# Altium schematic sheet TYPE_C&POWER.SchDoc
size A3
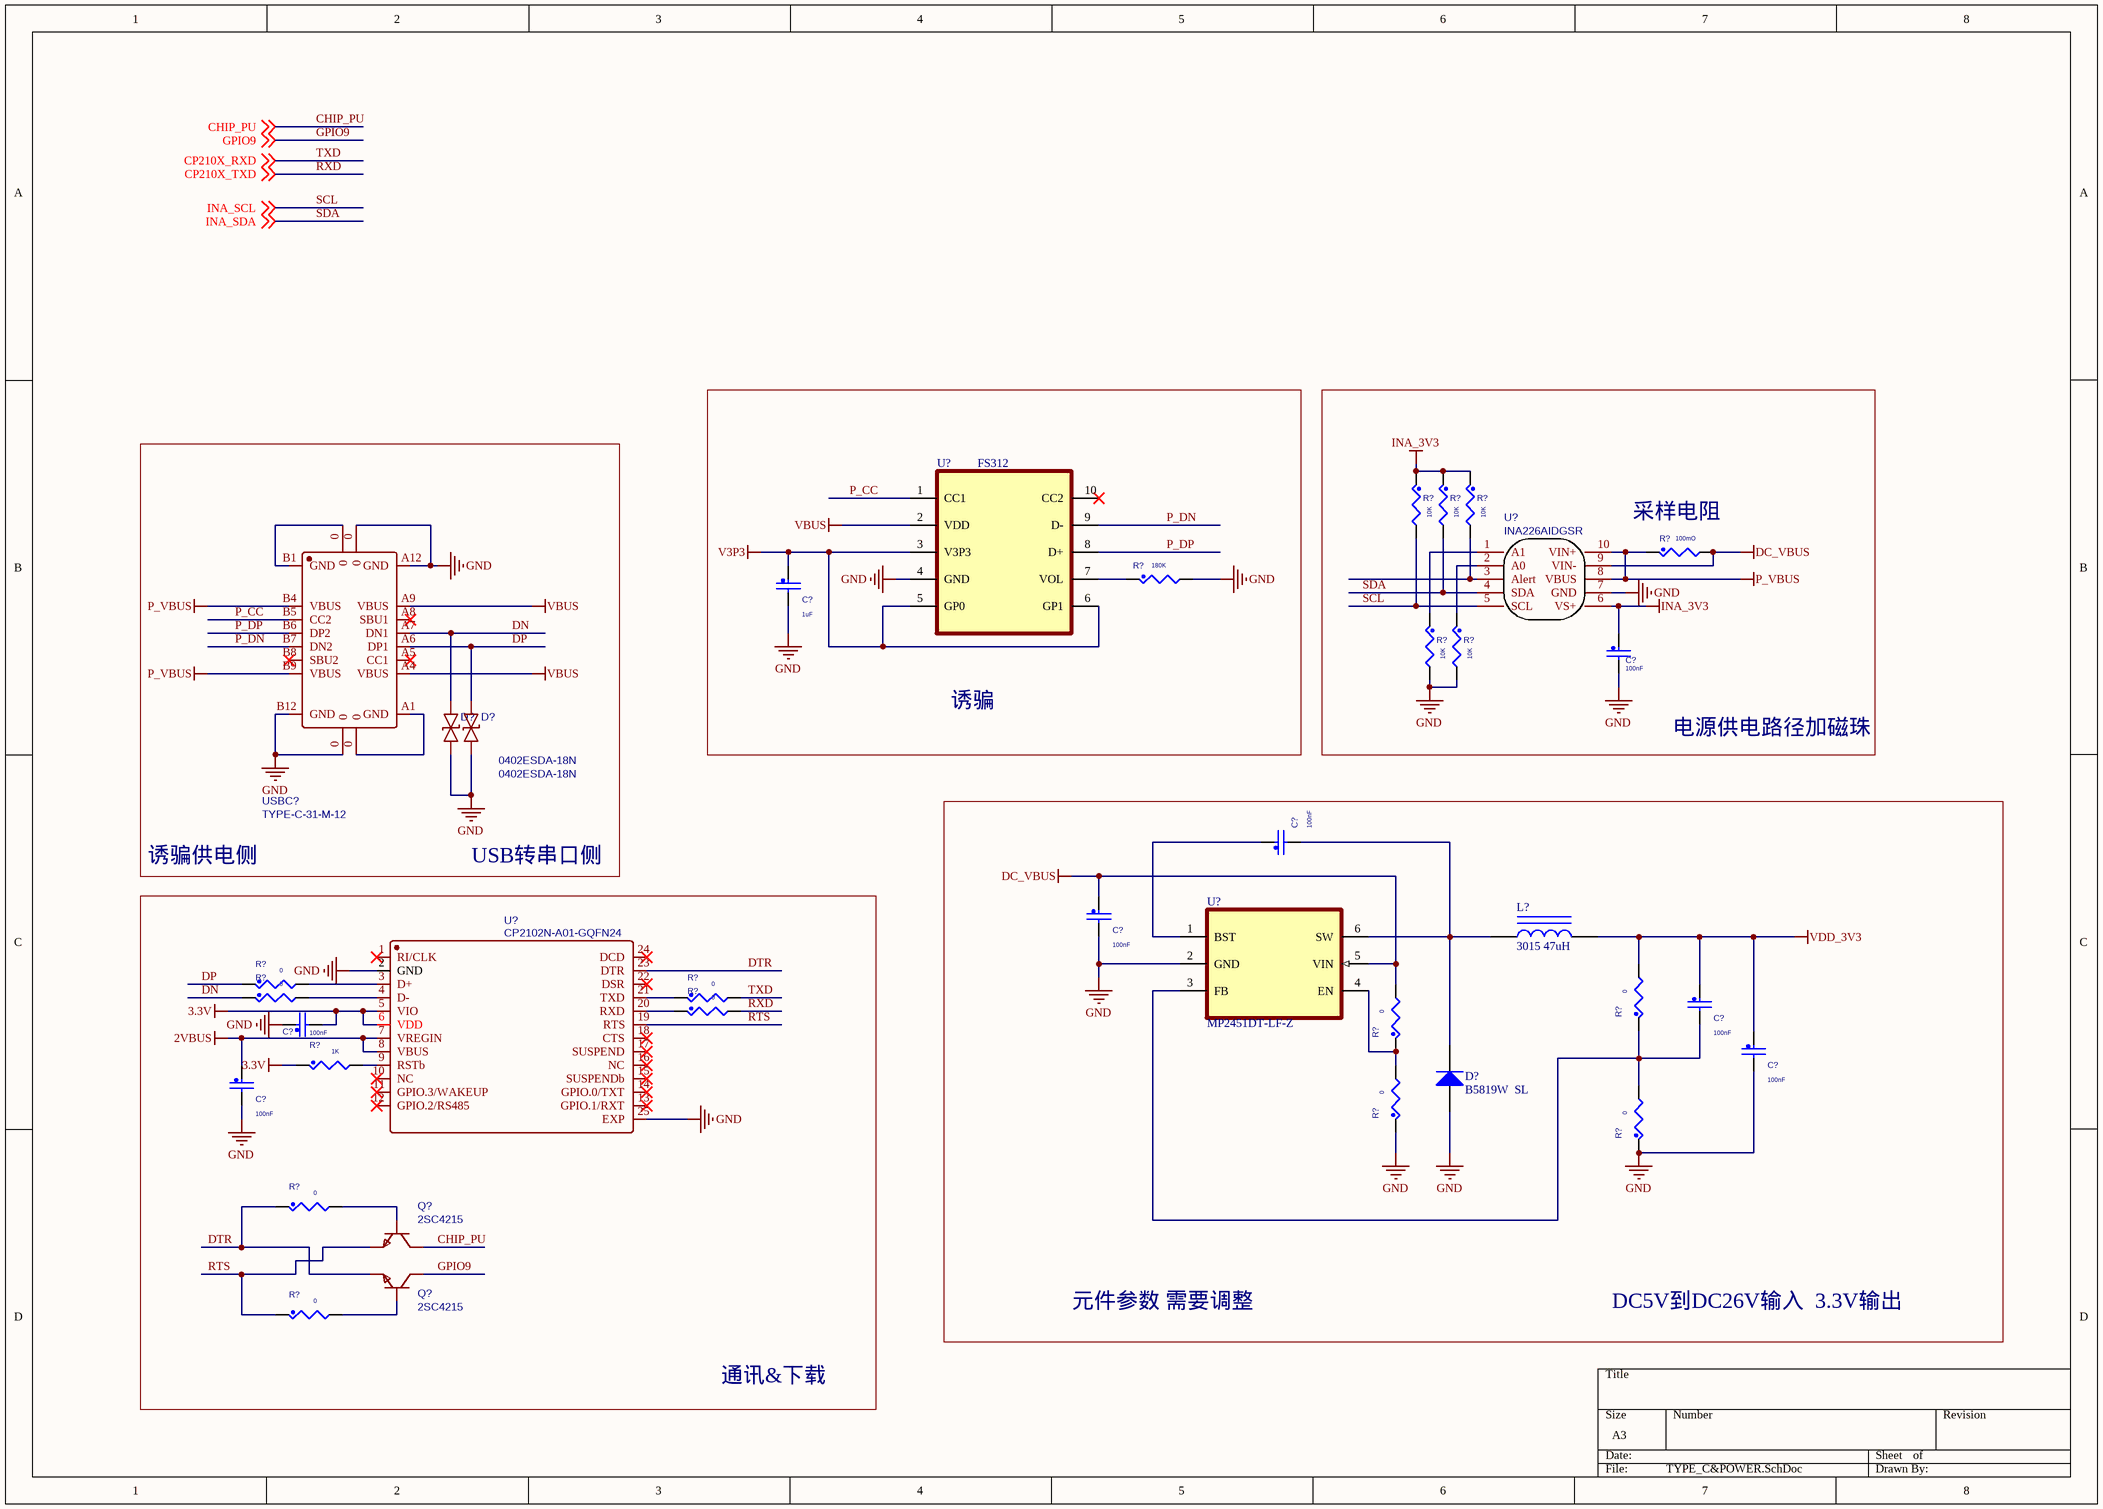
[diagram p0: TYPE_C&POWER.SchDoc]

## Parts
(Parts that share a designator on the sheet are numbered #1, #2 ... from top to bottom, then left to right.)
C?#1  1uF  [C0603]
C?#2  100nF  [C0603]
C?#3  100nF  [C0603]
C?#4  100nF  [C0603]
C?#5  100nF  [C0603]
C?#6  100nF  [C0603]
C?#7  100nF  [C0603]
C?#8  100nF  [C0603]
D?#1  0402ESDA-18N  [D0402-BI]
D?#2  0402ESDA-18N  [D0402-BI]
D?#3  B5819W  SL  [SOD-123]
L?  3015 47uH  [0603_L]
Q?#1  2SC4215  [SOT-323-3_L2.0-W1.3-P1.30-LS2.1-BR]
Q?#2  2SC4215  [SOT-323-3_L2.0-W1.3-P1.30-LS2.1-BR]
R?#1  10K  [R0603]
R?#2  10K  [R0603]
R?#3  10K  [R0603]
R?#4  100mO  [R0603]
R?#5  180K  [R0603]
R?#6  10K  [R0603]
R?#7  10K  [R0603]
R?#8  0  [R0603]
R?#9  0  [R0603]
R?#10  0  [R0603]
R?#11  0  [R0603]
R?#12  0  [R0603]
R?#13  0  [R0603]
R?#14  1K  [R0603]
R?#15  0  [R0603]
R?#16  0  [R0603]
R?#17  0  [R0603]
R?#18  0  [R0603]
U?#1  FS312  [FS312]
U?#2  INA226AIDGSR  [MSOP-10_L3.0-W3.0-P0.50-LS5.0-BL]
U?#3  MP2451DT-LF-Z  [SOT-23-6_L2.9-W1.6-P0.95-LS2.8-BR]
U?#4  CP2102N-A01-GQFN24  [QFN-24_L4.0-W4.0-P0.50-BL-EP2.6]
USBC?  TYPE-C-31-M-12  [USB-C_SMD-TYPE-C-31-M-12]

## Blocks framed on the sheet
诱骗: C?#1 R?#5 U?#1
通讯&下载: C?#6 C?#8 Q?#1 Q?#2 R?#8-R?#11 R?#14 R?#17 R?#18 U?#4

## Nets
2VBUS: C?#8.1 U?#4.7(VREGIN) U?#4.8(VBUS)
3.3V: C?#6.2 R?#14.1 U?#4.5(VIO) U?#4.6(VDD)
DC_VBUS: C?#4.1 R?#4.2 R?#13.2 U?#2.9(VIN-) U?#3.5(VIN)
GND: C?#1.2 C?#2.2 C?#4.2 C?#6.1 C?#7.2 C?#8.2 D?#1.1 D?#2.1 D?#3.1(A) R?#5.2 R?#6.2 R?#7.2 R?#15.1 R?#16.1 U?#1.4(GND) U?#2.7(GND) U?#3.2(GND) U?#4.2(GND) U?#4.25(EXP) USBC?.0 USBC?.A12(GND) USBC?.B12(GND)
INA_3V3: C?#2.1 R?#1.1 R?#2.1 R?#3.1 U?#2.6(VS+)
P_VBUS: R?#4.1 U?#2.8(VBUS) U?#2.10(VIN+) USBC?.B4(VBUS) USBC?.B9(VBUS)
V3P3: C?#1.1 U?#1.3(V3P3) U?#1.5(GP0) U?#1.6(GP1)
VBUS: U?#1.2(VDD) USBC?.A4(VBUS) USBC?.A9(VBUS)
VDD_3V3: C?#5.1 C?#7.1 L?.2 R?#12.2
CHIP_PU: Q?#1.3(C) ; off-sheet CHIP_PU
DN: D?#1.2 R?#9.1 USBC?.A7(DN1)
DP: D?#2.2 R?#8.1 USBC?.A6(DP1)
DTR: Q?#2.2(E) R?#17.1 U?#4.23(DTR)
GPIO9: Q?#2.3(C) ; off-sheet GPIO9
P_CC: U?#1.1(CC1) USBC?.B5(CC2)
P_DN: U?#1.9(D-) USBC?.B7(DN2)
P_DP: U?#1.8(D+) USBC?.B6(DP2)
RTS: Q?#1.2(E) R?#18.1 U?#4.19(RTS)
RXD: R?#11.2 ; off-sheet CP210X_TXD  [also labelled CP210X_TXD]
SCL: R?#1.2 U?#2.5(SCL) ; off-sheet INA_SCL  [also labelled INA_SCL]
SDA: R?#2.2 U?#2.4(SDA) ; off-sheet INA_SDA  [also labelled INA_SDA]
TXD: R?#10.2 ; off-sheet CP210X_RXD  [also labelled CP210X_RXD]
NetC?#3_1: C?#3.1 U?#3.1(BST)
NetC?#3_2: C?#3.2 D?#3.2(K) L?.1 U?#3.6(SW)
NetC?#5_2: C?#5.2 R?#12.1 R?#16.2 U?#3.3(FB)
NetQ?#1_1: Q?#1.1(B) R?#17.2
NetQ?#2_1: Q?#2.1(B) R?#18.2
NetR?#3_2: R?#3.2 U?#2.3(Alert)
NetR?#5_1: R?#5.1 U?#1.7(VOL)
NetR?#6_1: R?#6.1 U?#2.1(A1)
NetR?#7_1: R?#7.1 U?#2.2(A0)
NetR?#8_2: R?#8.2 U?#4.3(D+)
NetR?#9_2: R?#9.2 U?#4.4(D-)
NetR?#10_1: R?#10.1 U?#4.21(TXD)
NetR?#11_1: R?#11.1 U?#4.20(RXD)
NetR?#13_1: R?#13.1 R?#15.2 U?#3.4(EN)
NetR?#14_2: R?#14.2 U?#4.9(RSTb)
NetUSBC?_0: USBC?.0 USBC?.B1(GND)
NetUSBC?_0: USBC?.0 USBC?.A1(GND)  [a separate net that carries the same name]

Not connected (* = marked no-connect by the designer): U?#1 10(CC2)*; U?#4 1(RI/CLK)* 10(NC)* 11(GPIO.3/WAKEUP)* 12(GPIO.2/RS485)* 13(GPIO.1/RXT)* 14(GPIO.0/TXT)* 15(SUSPENDb)* 16(NC)* 17(SUSPEND)* 18(CTS)* 22(DSR)* 24(DCD)*; USBC? A5(CC1)* A8(SBU1)* B8(SBU2)*

## Notes on the sheet
- (near R?#4) 采样电阻
- 电源供电路径加磁珠
- 诱骗供电侧
- USB转串口侧
- 元件参数 需要调整
- DC5V到DC26V输入  3.3V输出

## Library data of the parts
C?#1-C?#8 = CAP_NP: CAP CER 22UF 6.3V 20% X5R 0603; CLASS: DISCRETE; AGILE_PN: 150-78467; MFG_NAME01: Samsung; MFG_PN01: CL10A226MQ8NRNE; CAD_APPROVED: Yes; FPLIST: CC0603_OV,CC0603,0603_CC; voltage rating: 6.3V; Tolerance: 20%; ROHS: Yes; HEIGHT: 1MM; VOLTAGE: 6.3V
D?#1 D?#2 = 0402ESDA-18N: BOM_Manufacturer: Bourne Semicon (Shenzhen); Contributor: LCSC; BOM_Supplier: LCSC; BOM_Supplier Part: C316050; BOM_Manufacturer Part: 0402ESDA-18N; BOM_JLCPCB Part Class: Extended Part; spicePre: D; spiceSymbolName: 0402ESDA-18N
D?#3 = SOD-123 B5819W  SL: 肖特基二极管; ComponentLink1Description: 供应商链接; ComponentLink1URL: http://www.szlcsc.com/product/details_9093.html; Package: SOD-123; Supplier: LC; SuppliersPartNumber: C8598
L? = 0603 33nH 5%: 贴片电感; ComponentLink1Description: 供应商链接; ComponentLink1URL: http://www.szlcsc.com/product/details_36021.html; Package: 0603; Supplier: LC; SuppliersPartNumber: C35050
Q?#1 Q?#2 = 2SC4215: BOM_Manufacturer: CJ; BOM_Supplier: LCSC; BOM_Manufacturer Part: 2SC4215; BOM_Supplier Part: C83013; BOM_JLCPCB Part Class: Extended Part; spicePre: Q; spiceSymbolName: 2SC4215
R?#1-R?#18 = RES: RES MF 10K 1/16W 5% 0402; CLASS: DISCRETE; FPLIST: RC0402_25,RC0402_HD,0402_CC; CAD_APPROVED: Yes; MFG_PN01: CRCW040210K0JNED; MFG_NAME01: VISHAY INTERTECHNOLOGY; AGILE_PN: 470-75557; HEIGHT: 0.4 MM; ROHS: Yes; Tolerance: 5%
U?#1 = FS312: MF: {'manufacturer': u'Texas Instruments'}; MP: LP2985AIM5-5.0; Availability: Unavailable; Price: None; Package: None; Value: *
U?#2 = INA226AIDGSR: BOM_Manufacturer: TI; BOM_Supplier: LCSC; BOM_Manufacturer Part: INA226AIDGSR; BOM_Supplier Part: C49851; BOM_JLCPCB Part Class: Extended Part; spicePre: U; spiceSymbolName: INA226AIDGSR
U?#3 = MP2451DT-LF-Z: MF: {'manufacturer': u'Texas Instruments'}; MP: LP2985AIM5-5.0; Availability: Unavailable; Price: None; Package: None; Value: *
U?#4 = CP2102N-A01-GQFN24: BOM_Manufacturer: SILICON LABS; Contributor: LCSC; BOM_Supplier: LCSC; BOM_Manufacturer Part: CP2102N-A01-GQFN24; BOM_Supplier Part: C80225; BOM_JLCPCB Part Class: Extended Part; spicePre: U; spiceSymbolName: CP2102N-A01-GQFN24
USBC? = TYPE-C-31-M-12: BOM_Manufacturer: Rectangular Connectors - Contacts; Contributor: LCSC; BOM_Supplier: LCSC; BOM_Supplier Part: C165948; BOM_Manufacturer Part: TYPE-C-31-M-12; BOM_JLCPCB Part Class: Extended Part; spicePre: U; spiceSymbolName: TYPE-C-31-M-12